# Altium schematic sheet Mics.SchDoc: Mic
size A4; SheetNumber: 4
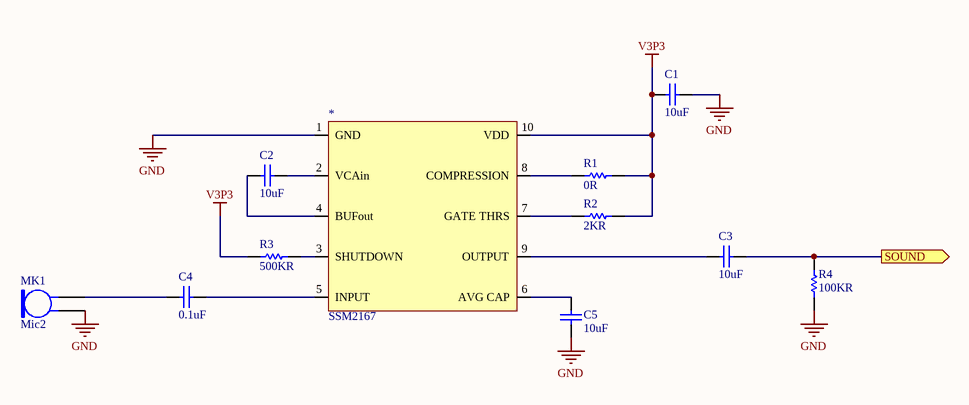
[diagram p0: Mics.SchDoc]

## Parts
*  SSM2167
C1  10uF  [RAD-0.3]
C2  10uF  [RAD-0.3]
C3  10uF  [RAD-0.3]
C4  0.1uF  [RAD-0.3]
C5  10uF  [RAD-0.3]
MK1  Mic2  [PIN2]
R1  0R  [AXIAL-0.3]
R2  2KR  [AXIAL-0.3]
R3  500KR  [AXIAL-0.3]
R4  100KR  [AXIAL-0.3]

## Ports
SOUND (out)

## Nets
GND: *.1(GND) C1.1 C5.2 MK1.1 R4.1
V3P3: *.10(VDD) C1.2 R1.1 R2.1 R3.2
SOUND: C3.1 R4.2 ; port SOUND
Net*_2: *.2(VCAin) C2.1
Net*_3: *.3(SHUTDOWN) R3.1
Net*_4: *.4(BUFout) C2.2
Net*_5: *.5(INPUT) C4.2
Net*_6: *.6(AVG_CAP) C5.1
Net*_7: *.7(GATE_THRS) R2.2
Net*_8: *.8(COMPRESSION) R1.2
Net*_9: *.9(OUTPUT) C3.2
NetC4_1: C4.1 MK1.2

## Notes on the sheet
- Title
- Size:
- Date:
- A4
- Number:
- Time:
- Revision:
- Sheet
- of
- File:

## Library data of the parts
* = SSM2167: Fabricant: ANALOG DEVICES; Fournisseur: Farnell; RefFabricant: SSM2167-1RMZ; RefFournisseur: 2067797
C1-C5 = Cap: Capacitor; Published: 8-Jun-2000; LatestRevisionDate: 17-Jul-2002; LatestRevisionNote: Re-released for DXP Platform.; PackageReference: RAD-0.3; Publisher: Altium Limited; PackageDescription: Radial Cap, Thru-Hole; 2 Leads; 0.3 in Pin Spacing
  C1-C3 C5: Value: 10uF
  C4: Value: 0.1uF
MK1 = Mic2: Microphone; Fabricant: PRO SIGNAL; Fournisseur: Farnell; RefFabricant: ABM-708-RC; RefFournisseur: 1736564; Published: 24-Mar-1999; LatestRevisionDate: 17-Jul-2002; LatestRevisionNote: Re-released for DXP Platform.; PackageReference: PIN2; Publisher: Altium Limited
R1-R4 = Res1: Resistor; Published: 8-Jun-2000; LatestRevisionDate: 17-Jul-2002; LatestRevisionNote: Re-released for DXP Platform.; PackageReference: AXIAL-0.3; Publisher: Altium Limited; PackageDescription: Axial Device, Thru-Hole; 2 Leads; 0.3 in Pin Spacing
  R1: Value: 0R
  R2: Value: 2KR
  R3: Value: 500KR
  R4: Value: 100KR